# EAGLE design EncoderAdapter (EAGLE 6.5.0)
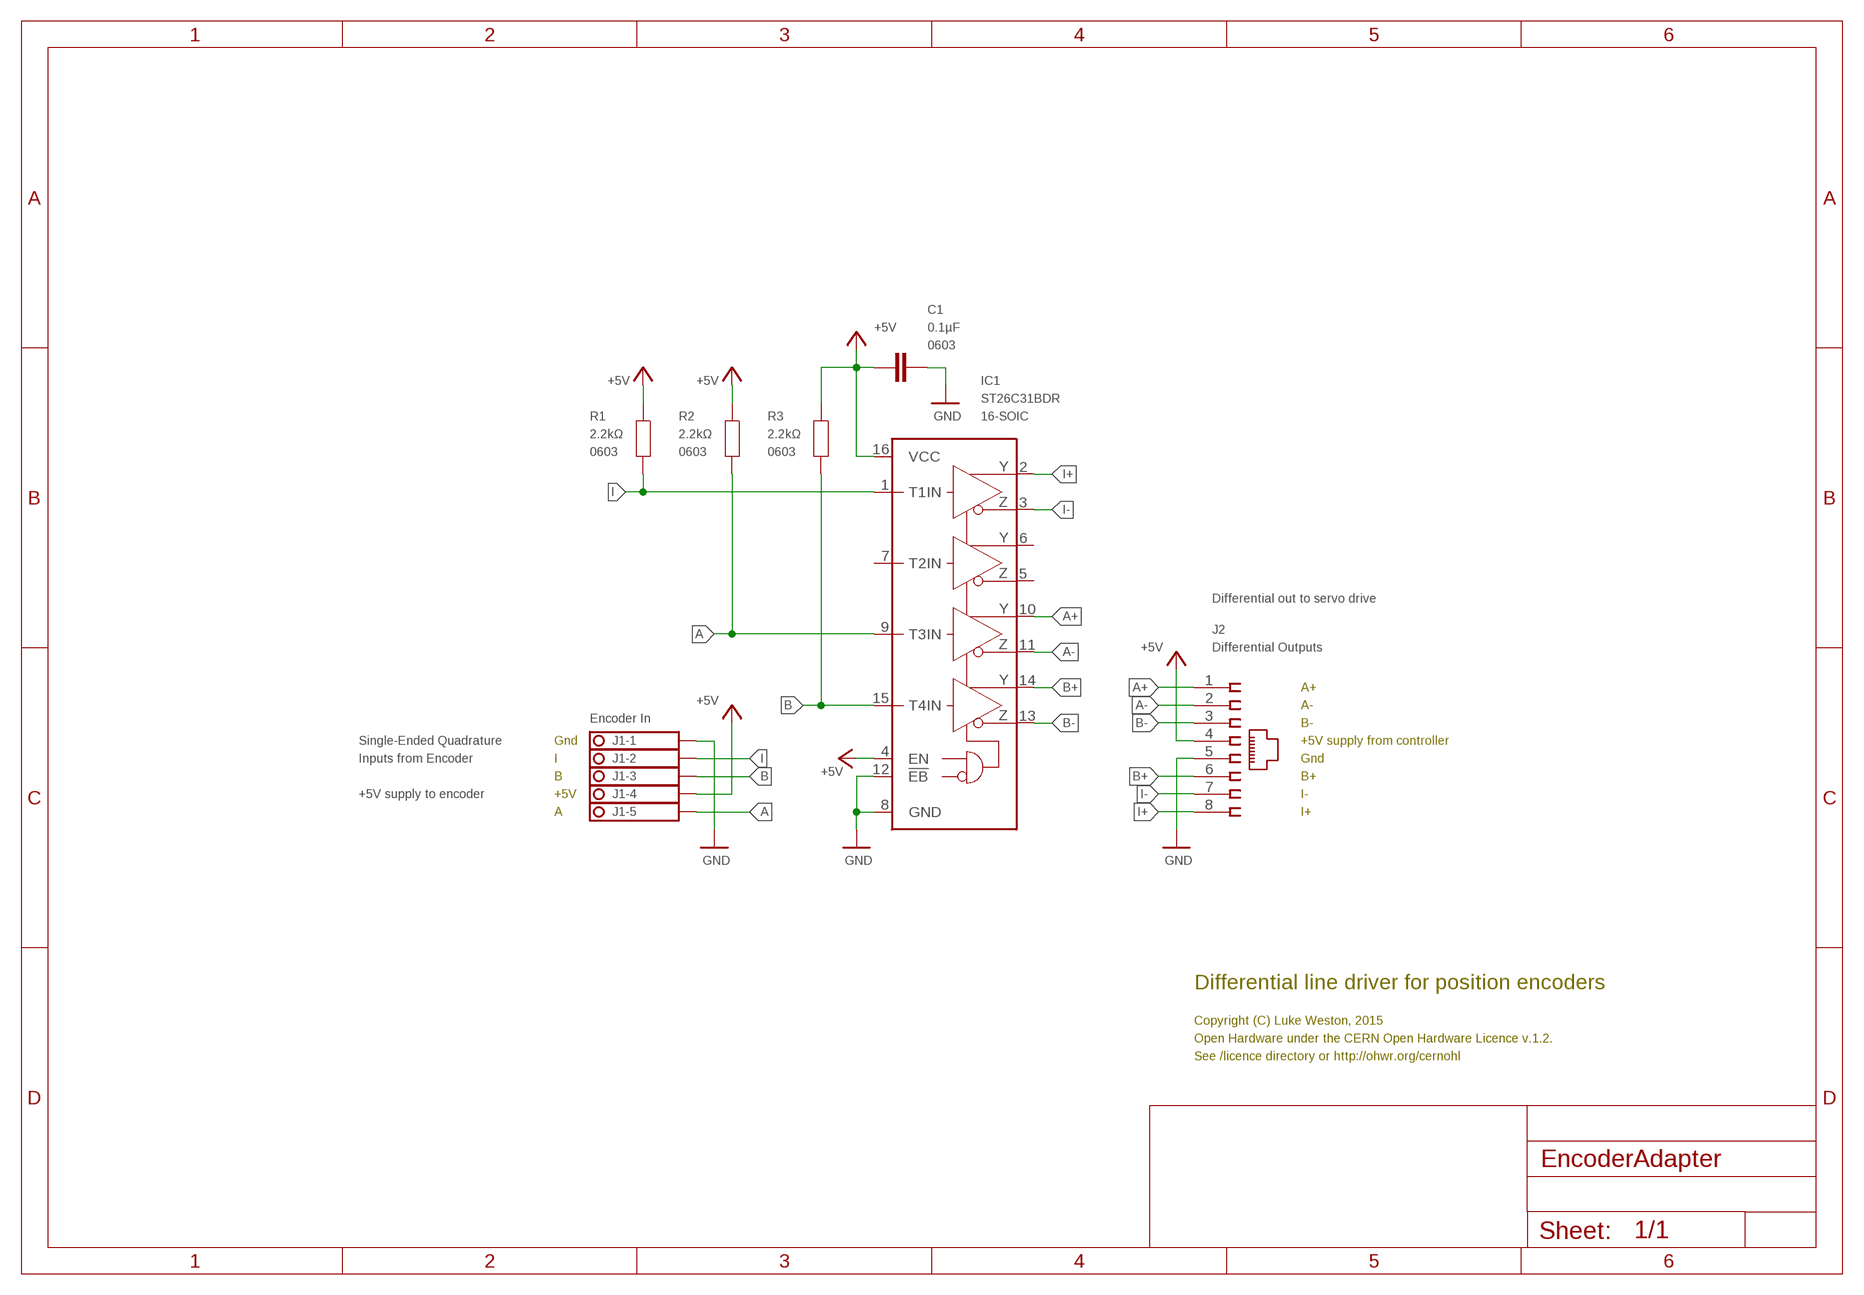
[diagram p0: schematic, sheet 1]

## Parts
C1  0.1µF  CAP0603  [0603]
IC1  ST26C31BDR  MAX3043CSE  [SO16]
J1  Encoder In  1751277  [1751277]
J2  Differential Outputs  215877-4  [215877-4]
R1  2.2kΩ  RESISTOR0603  [0603]
R2  2.2kΩ  RESISTOR0603  [0603]
R3  2.2kΩ  RESISTOR0603  [0603]

## Nets
+5V: C1.2 IC1.4(EN) IC1.16(VCC) J1.4 J2.4 R1.1 R2.1 R3.1
A: IC1.9(T3IN) J1.5 R2.2
A+: IC1.10(Y3) J2.1
A-: IC1.11(Z3) J2.2
B: IC1.15(T4IN) J1.3 R3.2
B+: IC1.14(Y4) J2.6
B-: IC1.13(Z4) J2.3
GND: C1.1 IC1.8(GND) IC1.12(!EB) J1.1 J2.5
I: IC1.1(T1IN) J1.2 R1.2
I+: IC1.2(Y1) J2.8
I-: IC1.3(Z1) J2.7
Unconnected: IC1.5(Z2) IC1.6(Y2) IC1.7(T2IN)

## Notes on the sheet
- Differential out to servo drive
- A+
- A-
- B-
- Single-Ended Quadrature | Gnd | +5V supply from controller
- Inputs from Encoder | I | Gnd
- B | B+
- +5V supply to encoder | +5V | I-
- A | I+
- Differential line driver for position encoders
- Copyright (C) Luke Weston, 2015
- Open Hardware under the CERN Open Hardware Licence v.1.2.
- See /licence directory or http://ohwr.org/cernohl

## Library data of the parts
C1 = freetronics-master-v1:CAP: Capacitor Standard 0603 ceramic capacitor, and 0.1" leaded capacitor.; PACKAGE: 0603
IC1 = maxim:MAX304*: ±10kV ESD-Protected, Quad 5V RS-485/422 Transmitters Source: MAX3040-MAX3045.pdf; MF: MAXIM; MPN: MAX3043CSE+; OC_FARNELL: unknown; OC_NEWARK: 37K7901; PACKAGE: 16-SOIC
J1 = con-phoenix-350:1751277: MKDS 1/ 5-3,5 Printklemme Nennstrom: 10 A Bemessungsspannung: 160 V Raster: 3,5 mm Polzahl: 5 Montageart: Löten Anschlussart: Schraubanschluss Anschlussrichtung vom Leiter zur Platine: 0° Source: http://eshop.phoenixcontact.com .. 1751277.pdf; OC_FARNELL: unknown; OC_NEWARK: unknown
J2 = con-amp:215877-4: AMP connector
R1-R3 = freetronics-master-v1:RESISTOR: Resistor Basic schematic elements and footprints for 0603, 1206, and PTH 1/10th watt (small) resistors.; PACKAGE: 0603

## Board
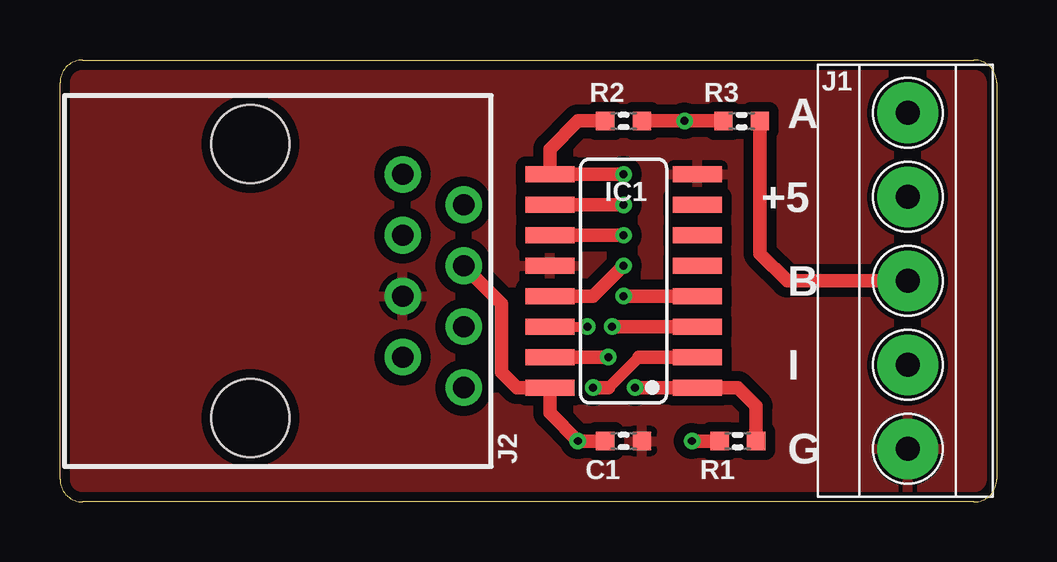
[diagram p1: board, top side]
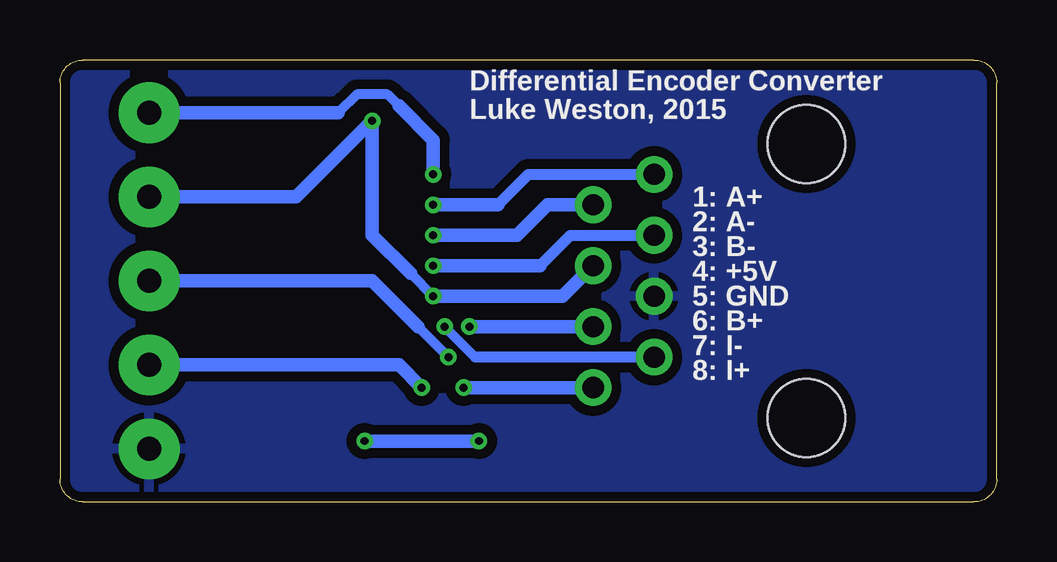
[diagram p2: board, bottom side, seen from below]

Size 39.05 x 18.41 mm. Coordinates in mm from the lower left corner, seen from the top.
Outline: 0,0.95 0,17.46 arc-90 0.95,18.41 38.1,18.41 arc-90 39.05,17.46 39.05,0.95 arc-90 38.1,0 0.95,0 arc-90 0,0.95
Copper layers (1*16): Top 0.0356mm / dielectric 1.5011mm / Bottom 0.0356mm
Design rules "LaenPCBOrder *": minimum track width 6mil, minimum drill 13mil, track to track 6mil, track to pad 6mil, pad to pad 6mil, via to via 6mil, smd to smd 6mil, copper to edge 15mil, drill to drill 6mil, minimum pad ring 7mil, minimum via ring 7mil, stop-mask expansion 3mil, vias tented up to drill 14mil, thermal gap 10mil

### Footprints (pad centres in the part's own frame; a part is rotated, then mirrored left to right if it is on the bottom)
0603 = smd 0.762 x 0.762: 1 -0.762,0; 2 0.762,0
SO16 = smd 0.66 x 2.032: 1 -4.445,-3.073; 2 -3.175,-3.073; 3 -1.905,-3.073; 4 -0.635,-3.073; 5 0.635,-3.073; 6 1.905,-3.073; 7 3.175,-3.073; 8 4.445,-3.073; 9 4.445,3.073; 10 3.175,3.073; 11 1.905,3.073; 12 0.635,3.073; 13 -0.635,3.073; 14 -1.905,3.073; 15 -3.175,3.073; 16 -4.445,3.073
1751277 = drill 1 pad 2.54: 1 -7,-0.1; 2 -3.5,-0.1; 3 0,-0.1; 4 3.5,-0.1; 5 7,-0.1
215877-4 = drill 0.889 pad 1.524: 1 -4.445,6.35; 2 -3.175,8.89; 3 -1.905,6.35; 4 -0.635,8.89; 5 0.635,6.35; 6 1.905,8.89; 7 3.175,6.35; 8 4.445,8.89 | hole 3.251: -5.715,0; 5.715,0

### Placement (x,y rotation side)
C1  23.5,2.54 180 top
IC1  23.5,9.21 90 top
J1  35.24,9.21 90 top
J2  7.94,9.21 270 top
R1  28.26,2.54 0 top
R2  23.5,15.88 180 top
R3  28.42,15.88 0 top

### Tracks (layer width: path | path; a pad name or v marks a point on that pad's centre or on a via)
+5V  (via drill 0.33)
  Top 0.254: IC1.16 20.64,4.76
  Top 0.559: C1.2 v21.59,2.54 20.42,3.71 IC1.16 19.05,4.76 18.41,5.4 18.41,8.26 J2.4 | IC1.4 v23.5,8.57 | R1.1 v26.35,2.54 | R2.1 v26.04,15.88 R3.1
  Bottom 0.406: 24.45,9.53 v23.5,8.57
  Bottom 0.559: v23.5,8.57 18.1,8.57 J2.4 | v26.35,2.54 v21.59,2.54 | J1.4 29.2,12.71 v26.04,15.88 26.04,11.11 24.45,9.53
A  (via drill 0.33)
  Top 0.559: R2.2 21.59,15.88 20.42,14.71 IC1.9 v23.5,13.65
  Bottom 0.406: 27.45,16.21 26.67,16.99 25.4,16.99 24.92,16.51
  Bottom 0.559: v23.5,13.65 23.5,15.08 24.92,16.51 | J1.5 27.45,16.21
A+  (via drill 0.33)
  Top 0.559: v23.5,12.38 IC1.10
  Bottom 0.457: 20.8,12.38 19.53,13.65 J2.1
  Bottom 0.559: v23.5,12.38 20.8,12.38
A-  (via drill 0.33)
  Top 0.559: v23.5,11.11 IC1.11
  Bottom 0.559: v23.5,11.11 20,11.11 18.73,12.38 J2.2
B  (via drill 0.33)
  Top 0.559: v22.86,6.03 IC1.15 | J1.3 30.32,9.21 29.18,10.35 R3.2
  Bottom 0.406: 24.13,7.3 v22.86,6.03
  Bottom 0.559: J1.3 26.04,9.21 24.13,7.3
B+  (via drill 0.33)
  Top 0.406: IC1.14 v21.99,7.3
  Bottom 0.559: v21.99,7.3 J2.6
B-  (via drill 0.33)
  Top 0.559: v23.5,9.84 22.23,8.57 IC1.13
  Bottom 0.457: 19.05,9.84 17.78,11.11 J2.3
  Bottom 0.559: v23.5,9.84 19.05,9.84
GND
  pour Top (isolate 0.406): 0,0 0,18.41 39.05,18.41 39.05,0
  pour Bottom (isolate 0.406): 0,0 0,18.41 39.05,18.41 39.05,0
I  (via drill 0.33)
  Top 0.559: v23.97,4.76 IC1.1 28.26,4.76 29.02,4 R1.2
  Bottom 0.559: J1.2 24.92,5.71 v23.97,4.76
I+  (via drill 0.33)
  Top 0.457: 22.86,4.76 24.13,6.03
  Top 0.559: 24.13,6.03 IC1.2 | v22.23,4.76 22.86,4.76
  Bottom 0.559: J2.8 v22.23,4.76
I-  (via drill 0.33)
  Top 0.559: v23.02,7.3 IC1.3
  Bottom 0.406: 21.75,6.03 v23.02,7.3
  Bottom 0.457: J2.7 21.75,6.03

### Text on the board
tPlace: A | +5 | B | I | G
bPlace: Differential Encoder Converter | Luke Weston, 2015 | 1: A+ | 2: A- | 3: B- | 4: +5V | 5: GND | 6: B+ | 7: I- | 8: I+